# Altium schematic sheet DCDC.SchDoc
size D
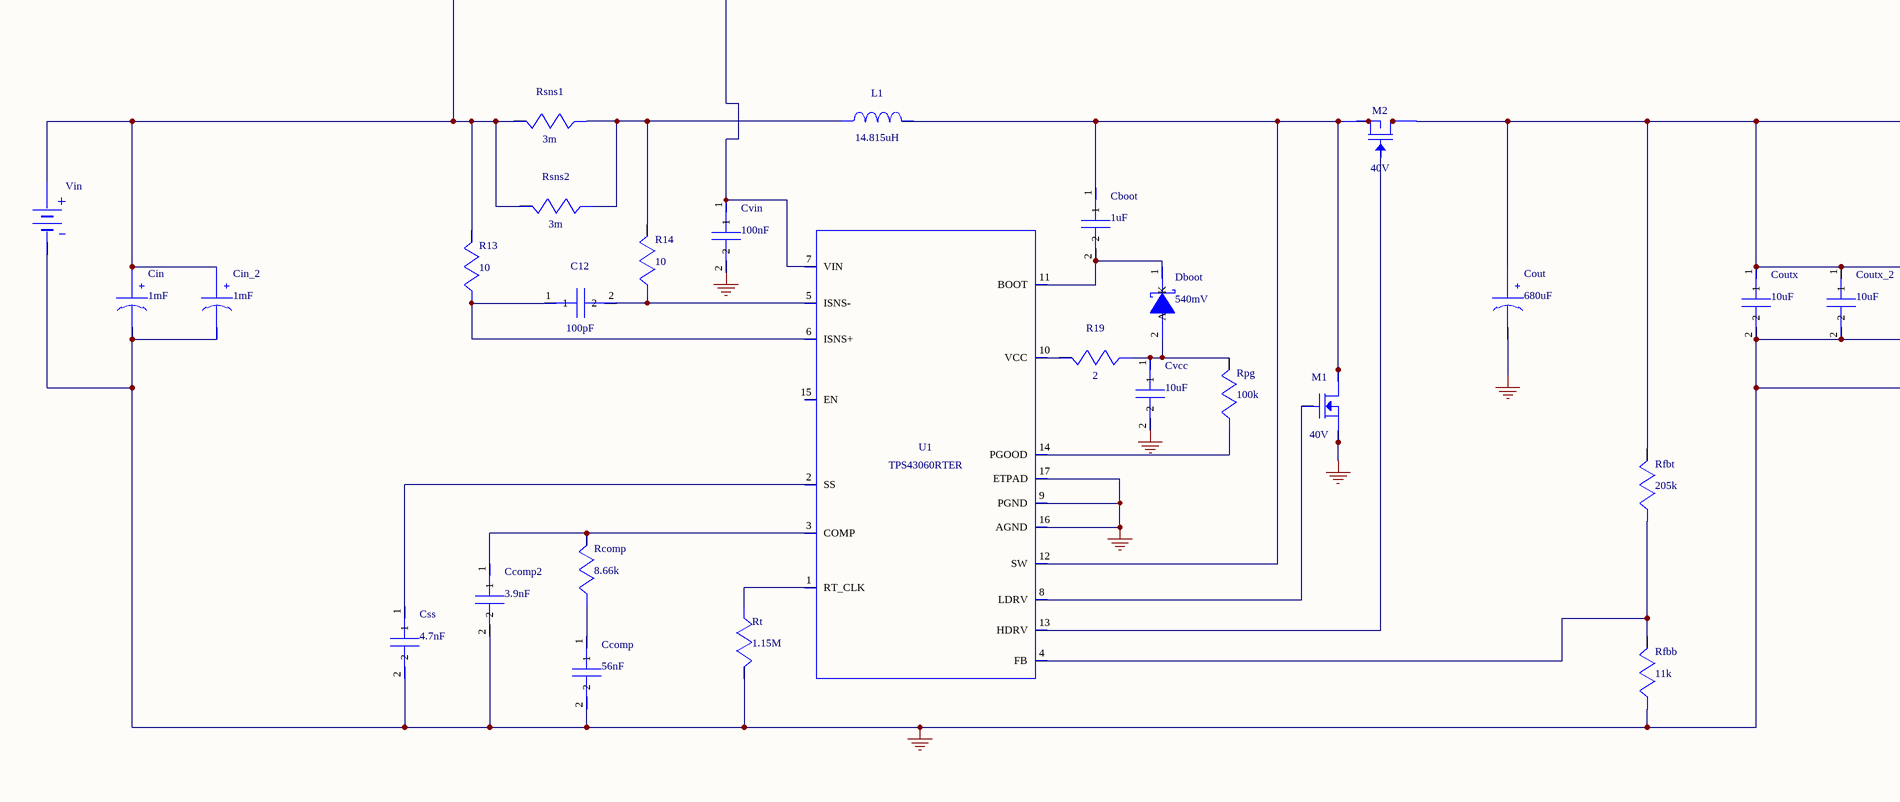
[diagram p0: DCDC.SchDoc, left]
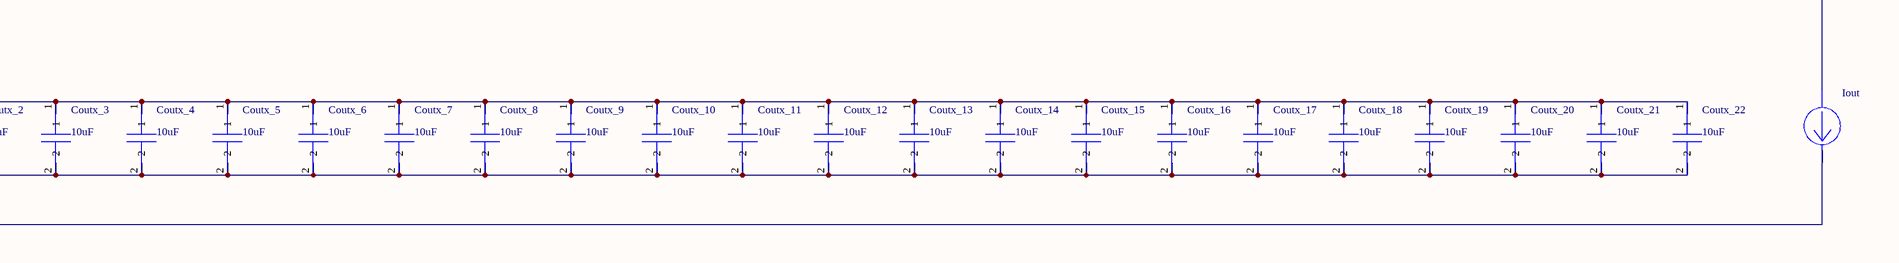
[diagram p1: DCDC.SchDoc, right]

## Parts
C12  value 100pF  (hidden comment: 06035A101JAT2A)
Cboot  value 1uF  (hidden comment: GRM188R61C105KA93D)
Ccomp  value 56nF  (hidden comment: GRM155R61A563KA01D)
Ccomp2  value 3.9nF  (hidden comment: CC0805KRX7R9BB392)
Cin  value 1mF  (hidden comment: 16SVPF1000M)
Cin_2  value 1mF  (hidden comment: 16SVPF1000M)
Cout  value 680uF  (hidden comment: EEV-FK1H681M)
Coutx  value 10uF  (hidden comment: C3216JB1H106K)
Coutx_2  value 10uF  (hidden comment: C3216JB1H106K)
Coutx_3  value 10uF  (hidden comment: C3216JB1H106K)
Coutx_4  value 10uF  (hidden comment: C3216JB1H106K)
Coutx_5  value 10uF  (hidden comment: C3216JB1H106K)
Coutx_6  value 10uF  (hidden comment: C3216JB1H106K)
Coutx_7  value 10uF  (hidden comment: C3216JB1H106K)
Coutx_8  value 10uF  (hidden comment: C3216JB1H106K)
Coutx_9  value 10uF  (hidden comment: C3216JB1H106K)
Coutx_10  value 10uF  (hidden comment: C3216JB1H106K)
Coutx_11  value 10uF  (hidden comment: C3216JB1H106K)
Coutx_12  value 10uF  (hidden comment: C3216JB1H106K)
Coutx_13  value 10uF  (hidden comment: C3216JB1H106K)
Coutx_14  value 10uF  (hidden comment: C3216JB1H106K)
Coutx_15  value 10uF  (hidden comment: C3216JB1H106K)
Coutx_16  value 10uF  (hidden comment: C3216JB1H106K)
Coutx_17  value 10uF  (hidden comment: C3216JB1H106K)
Coutx_18  value 10uF  (hidden comment: C3216JB1H106K)
Coutx_19  value 10uF  (hidden comment: C3216JB1H106K)
Coutx_20  value 10uF  (hidden comment: C3216JB1H106K)
Coutx_21  value 10uF  (hidden comment: C3216JB1H106K)
Coutx_22  value 10uF  (hidden comment: C3216JB1H106K)
Css  value 4.7nF  (hidden comment: GRM188R71E472KA01D)
Cvcc  value 10uF  (hidden comment: GRM188R61C106MA73D)
Cvin  value 100nF  (hidden comment: 08053C104KAT2A)
Dboot  value 540mV  (hidden comment: XBS104S13R-G)
Iout  WB_CURRENT_LOAD  (value not drawn)
L1  value 14.815uH  (hidden comment: GENERIC_INDUCTOR)
M1  value 40V  (hidden comment: FDMS8460)
M2  value 40V  (hidden comment: CSD18509Q5B)
R13  value 10  (hidden comment: CRCW040210R0FKED)
R14  value 10  (hidden comment: CRCW040210R0FKED)
R19  value 2  (hidden comment: CRCW04022R00FKED)
Rcomp  value 8.66k  (hidden comment: CRCW04028K66FKED)
Rfbb  value 11k  (hidden comment: CRCW040211K0FKED)
Rfbt  value 205k  (hidden comment: CRCW0402205KFKED)
Rpg  value 100k  (hidden comment: CRCW0402100KFKED)
Rsns1  value 3m  (hidden comment: WSR33L000FEA)
Rsns2  value 3m  (hidden comment: WSR33L000FEA)
Rt  value 1.15M  (hidden comment: CRCW04021M15FKED)
U1  TPS43060RTER
Vin  WB_BATTERY  (value not drawn)

## Nets
0: Ccomp.2 Ccomp2.2 Cin.2(-) Cin_2.2(-) Cout.2(-) Coutx.2 Coutx_2.2 Coutx_3.2 Coutx_4.2 Coutx_5.2 Coutx_6.2 Coutx_7.2 Coutx_8.2 Coutx_9.2 Coutx_10.2 Coutx_11.2 Coutx_12.2 Coutx_13.2 Coutx_14.2 Coutx_15.2 Coutx_16.2 Coutx_17.2 Coutx_18.2 Coutx_19.2 Coutx_20.2 Coutx_21.2 Coutx_22.2 Css.2 Cvcc.2 Cvin.2 Iout.2(-) M1.1(Source) M1.2(Source) M1.3(Source) Rfbb.2 Rt.1 U1.9(PGND) U1.16(AGND) U1.17(ETPAD) Vin.2(-)
NetC12_1: C12.1 R13.2 U1.6(ISNS+)
NetC12_2: C12.2 R14.2 U1.5(ISNS-)
NetCboot_1: Cboot.1 L1.1 M1.5(Drain) M1.6(Drain) M1.7(Drain) M1.8(Drain) U1.12(SW)
NetCboot_2: Cboot.2 Dboot.1(K) U1.11(BOOT)
NetCcomp2_1: Ccomp2.1 Rcomp.1 U1.3(COMP)
NetCcomp_1: Ccomp.1 Rcomp.2
NetCin_1: Cin.1(+) Cin_2.1(+) Cvin.1 R13.1 Rsns1.1 Rsns2.1 U1.7(VIN) Vin.1(+)
NetCout_1: Cout.1(+) Coutx.1 Coutx_2.1 Coutx_3.1 Coutx_4.1 Coutx_5.1 Coutx_6.1 Coutx_7.1 Coutx_8.1 Coutx_9.1 Coutx_10.1 Coutx_11.1 Coutx_12.1 Coutx_13.1 Coutx_14.1 Coutx_15.1 Coutx_16.1 Coutx_17.1 Coutx_18.1 Coutx_19.1 Coutx_20.1 Coutx_21.1 Coutx_22.1 Iout.1(+) Rfbt.1
NetCss_1: Css.1 U1.2(SS)
NetCvcc_1: Cvcc.1 Dboot.2(A) R19.2 Rpg.1
NetL1_2: L1.2 R14.1 Rsns1.2 Rsns2.2
NetM1_4: M1.4(Gate) U1.8(LDRV)
NetM2_1: M2.1(Source) M2.2(Source) M2.3(Source)
NetM2_4: M2.4(Gate) U1.13(HDRV)
NetM2_5: M2.5(Drain) M2.6(Drain) M2.7(Drain) M2.8(Drain) M2.9(Drain)
NetR19_1: R19.1 U1.10(VCC)
NetRfbb_1: Rfbb.1 Rfbt.2 U1.4(FB)
NetRpg_2: Rpg.2 U1.14(PGOOD)
NetRt_2: Rt.2 U1.1(RT_CLK)

Not connected (* = marked no-connect by the designer): U1 15(EN)

## Library data of the parts
C12 = 06035A101JAT2A: Manufacturer Name: AVX; PackageReference: 06035A101JAT2A; Manufacturer Part Number: 06035A101JAT2A
Cboot = GRM188R61C105KA93D: GRM188R61C105KA9; Manufacturer Name: MuRata; PackageReference: GRM188R61C105KA93D; Manufacturer Part Number: GRM188R61C105KA93D
Ccomp = GRM155R61A563KA01D: GRM155R61A563KA0; Manufacturer Name: MuRata; PackageReference: GRM155R61A563KA01D; Manufacturer Part Number: GRM155R61A563KA01D
Ccomp2 = CC0805KRX7R9BB392: CC0805KRX7R9BB39; Manufacturer Name: Yageo America; PackageReference: CC0805KRX7R9BB392; Manufacturer Part Number: CC0805KRX7R9BB392
Cin Cin_2 = 16SVPF1000M: Manufacturer Name: Panasonic; PackageReference: 16SVPF1000M; Manufacturer Part Number: 16SVPF1000M
Cout = EEV-FK1H681M: Manufacturer Name: Panasonic; PackageReference: EEV-FK1H681M; Manufacturer Part Number: EEV-FK1H681M
Coutx Coutx_2-Coutx_22 = C3216JB1H106K: Manufacturer Name: TDK; PackageReference: C3216JB1H106K; Manufacturer Part Number: C3216JB1H106K
Css = GRM188R71E472KA01D: GRM188R71E472KA0; Manufacturer Name: MuRata; PackageReference: GRM188R71E472KA01D; Manufacturer Part Number: GRM188R71E472KA01D
Cvcc = GRM188R61C106MA73D: GRM188R61C106MA7; Manufacturer Name: MuRata; PackageReference: GRM188R61C106MA73D; Manufacturer Part Number: GRM188R61C106MA73D
Cvin = 08053C104KAT2A: Manufacturer Name: AVX; PackageReference: 08053C104KAT2A; Manufacturer Part Number: 08053C104KAT2A
Dboot = XBS104S13R-G: Manufacturer Name: Torex USA Corporation; PackageReference: XBS104S13R-G; Manufacturer Part Number: XBS104S13R-G
L1 = GENERIC_INDUCTOR: CUSTOM1; Manufacturer Name: CUSTOM; PackageReference: CUSTOM; Manufacturer Part Number: GENERIC_INDUCTOR
M1 = FDMS8460: Manufacturer Name: Fairchild Semiconductor; PackageReference: FDMS8460; Manufacturer Part Number: FDMS8460
M2 = CSD18509Q5B: Manufacturer Name: Texas Instruments; PackageReference: CSD18509Q5B; Manufacturer Part Number: CSD18509Q5B
R13 R14 = CRCW040210R0FKED: Manufacturer Name: Vishay-Dale; PackageReference: CRCW040210R0FKED; Manufacturer Part Number: CRCW040210R0FKED
R19 = CRCW04022R00FKED: Manufacturer Name: Vishay-Dale; PackageReference: CRCW04022R00FKED; Manufacturer Part Number: CRCW04022R00FKED
Rcomp = CRCW04028K66FKED: Manufacturer Name: Vishay-Dale; PackageReference: CRCW04028K66FKED; Manufacturer Part Number: CRCW04028K66FKED
Rfbb = CRCW040211K0FKED: Manufacturer Name: Vishay-Dale; PackageReference: CRCW040211K0FKED; Manufacturer Part Number: CRCW040211K0FKED
Rfbt = CRCW0402205KFKED: Manufacturer Name: Vishay-Dale; PackageReference: CRCW0402205KFKED; Manufacturer Part Number: CRCW0402205KFKED
Rpg = CRCW0402100KFKED: Manufacturer Name: Vishay-Dale; PackageReference: CRCW0402100KFKED; Manufacturer Part Number: CRCW0402100KFKED
Rsns1 Rsns2 = WSR33L000FEA: Manufacturer Name: Vishay-Dale; PackageReference: WSR33L000FEA; Manufacturer Part Number: WSR33L000FEA
Rt = CRCW04021M15FKED: Manufacturer Name: Vishay-Dale; PackageReference: CRCW04021M15FKED; Manufacturer Part Number: CRCW04021M15FKED
U1 = TPS43060RTER: Manufacturer Name: Texas Instruments; PackageReference: TPS43060RTER; Manufacturer Part Number: TPS43060RTER; Value: Value
Iout = WB_CURRENT_LOAD: PackageReference: WB_CURRENT_LOAD; Manufacturer Part Number: WB_CURRENT_LOAD; Manufacturer Name: WB_CURRENT_LOAD; Value: N/A
Vin = WB_BATTERY: PackageReference: WB_BATTERY; Manufacturer Part Number: WB_BATTERY; Manufacturer Name: WB_BATTERY; Value: N/A